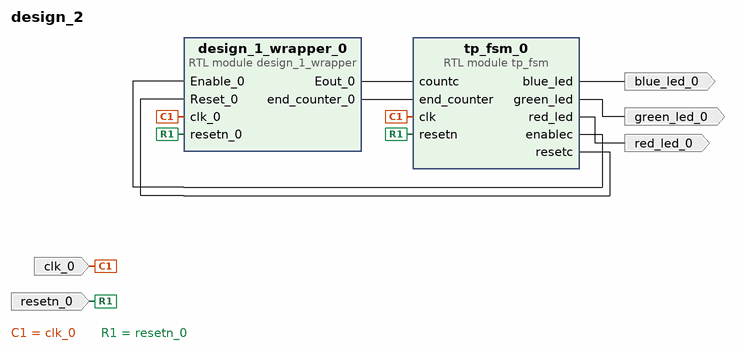
[diagram p0: block diagram of the top level]
# Vivado block design design_2, xc7z010clg400-1, Vivado 2024.1
create_bd_design design_2

create_bd_port -dir I -type clk clk_0
create_bd_port -dir I -type rst resetn_0
create_bd_port -dir O blue_led_0
create_bd_port -dir O red_led_0
create_bd_port -dir O green_led_0

create_bd_cell -type module -reference design_1_wrapper design_1_wrapper_0
create_bd_cell -type module -reference tp_fsm tp_fsm_0

# ---- connections ----

connect_bd_net -net clk_0_1 [get_bd_ports clk_0] [get_bd_pins tp_fsm_0/clk] [get_bd_pins design_1_wrapper_0/clk_0]
connect_bd_net [get_bd_pins design_1_wrapper_0/Eout_0] [get_bd_pins tp_fsm_0/countc]
connect_bd_net [get_bd_pins design_1_wrapper_0/end_counter_0] [get_bd_pins tp_fsm_0/end_counter]
connect_bd_net -net resetn_0_1 [get_bd_ports resetn_0] [get_bd_pins tp_fsm_0/resetn] [get_bd_pins design_1_wrapper_0/resetn_0]
connect_bd_net [get_bd_pins tp_fsm_0/blue_led] [get_bd_ports blue_led_0]
connect_bd_net [get_bd_pins tp_fsm_0/enablec] [get_bd_pins design_1_wrapper_0/Enable_0]
connect_bd_net [get_bd_pins tp_fsm_0/green_led] [get_bd_ports green_led_0]
connect_bd_net [get_bd_pins tp_fsm_0/red_led] [get_bd_ports red_led_0]
connect_bd_net [get_bd_pins tp_fsm_0/resetc] [get_bd_pins design_1_wrapper_0/Reset_0]

validate_bd_design
save_bd_design
